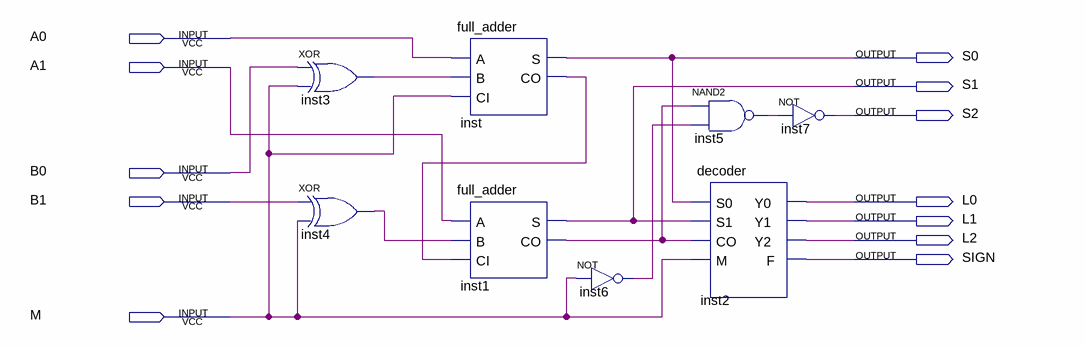
[diagram p0: schematic sheet]
// Quartus schematic SimpleLogicalCircuit.bdf as structural Verilog: 8 symbols, 12 pins
module SimpleLogicalCircuit (
  input  A0,
  input  A1,
  input  B0,
  input  B1,
  input  M,
  output S0,
  output S1,
  output S2,
  output L0,
  output L1,
  output L2,
  output SIGN
);

  wire inst1_co, inst3_out, inst4_out, inst5_out, inst6_out, inst_co;

  xor inst3 (inst3_out, B0, M);
  xor inst4 (inst4_out, B1, M);
  full_adder inst (.A(A0), .B(inst3_out), .CI(M), .S(S0), .CO(inst_co));
  full_adder inst1 (.A(A1), .B(inst4_out), .CI(inst_co), .S(S1), .CO(inst1_co));
  not inst6 (inst6_out, M);
  nand inst5 (inst5_out, inst1_co, inst6_out);
  decoder inst2 (.S0(S0), .S1(S1), .CO(inst1_co), .M(M), .Y0(L0), .Y1(L1), .Y2(L2), .F(SIGN));
  not inst7 (S2, inst5_out);
endmodule
